# Altium project BEAGLEPLAYV020_220915.PrjPcb (part 6 of 10)

## Sheet 012_SoC DDS & HDMI.SchDoc
size 420 x 297 mm; Page Create Date: May 29, 2006; WebSite: https://www.seeedstudio.com; Variant Name: <Core Design>; Page Number: 12; Drawing: qxn; Schematic Name: BeaglePlay; Page Size: A3; Comment: Seeed Title; Page Count: 22; Page Name: 012_SoC DDS & HDMI; Company: Seeed Studio; RevCode: v0.2; DsnPath: C:\Users\a0488739\Documents\GitHub\beagleplay\allegro\DVT\BEAGLEPLAYV020_220915.DSN; SchematicName: BeaglePlay; PageName: 012_SoC DDS & HDMI; PageSize: A3; TopSchematic: True
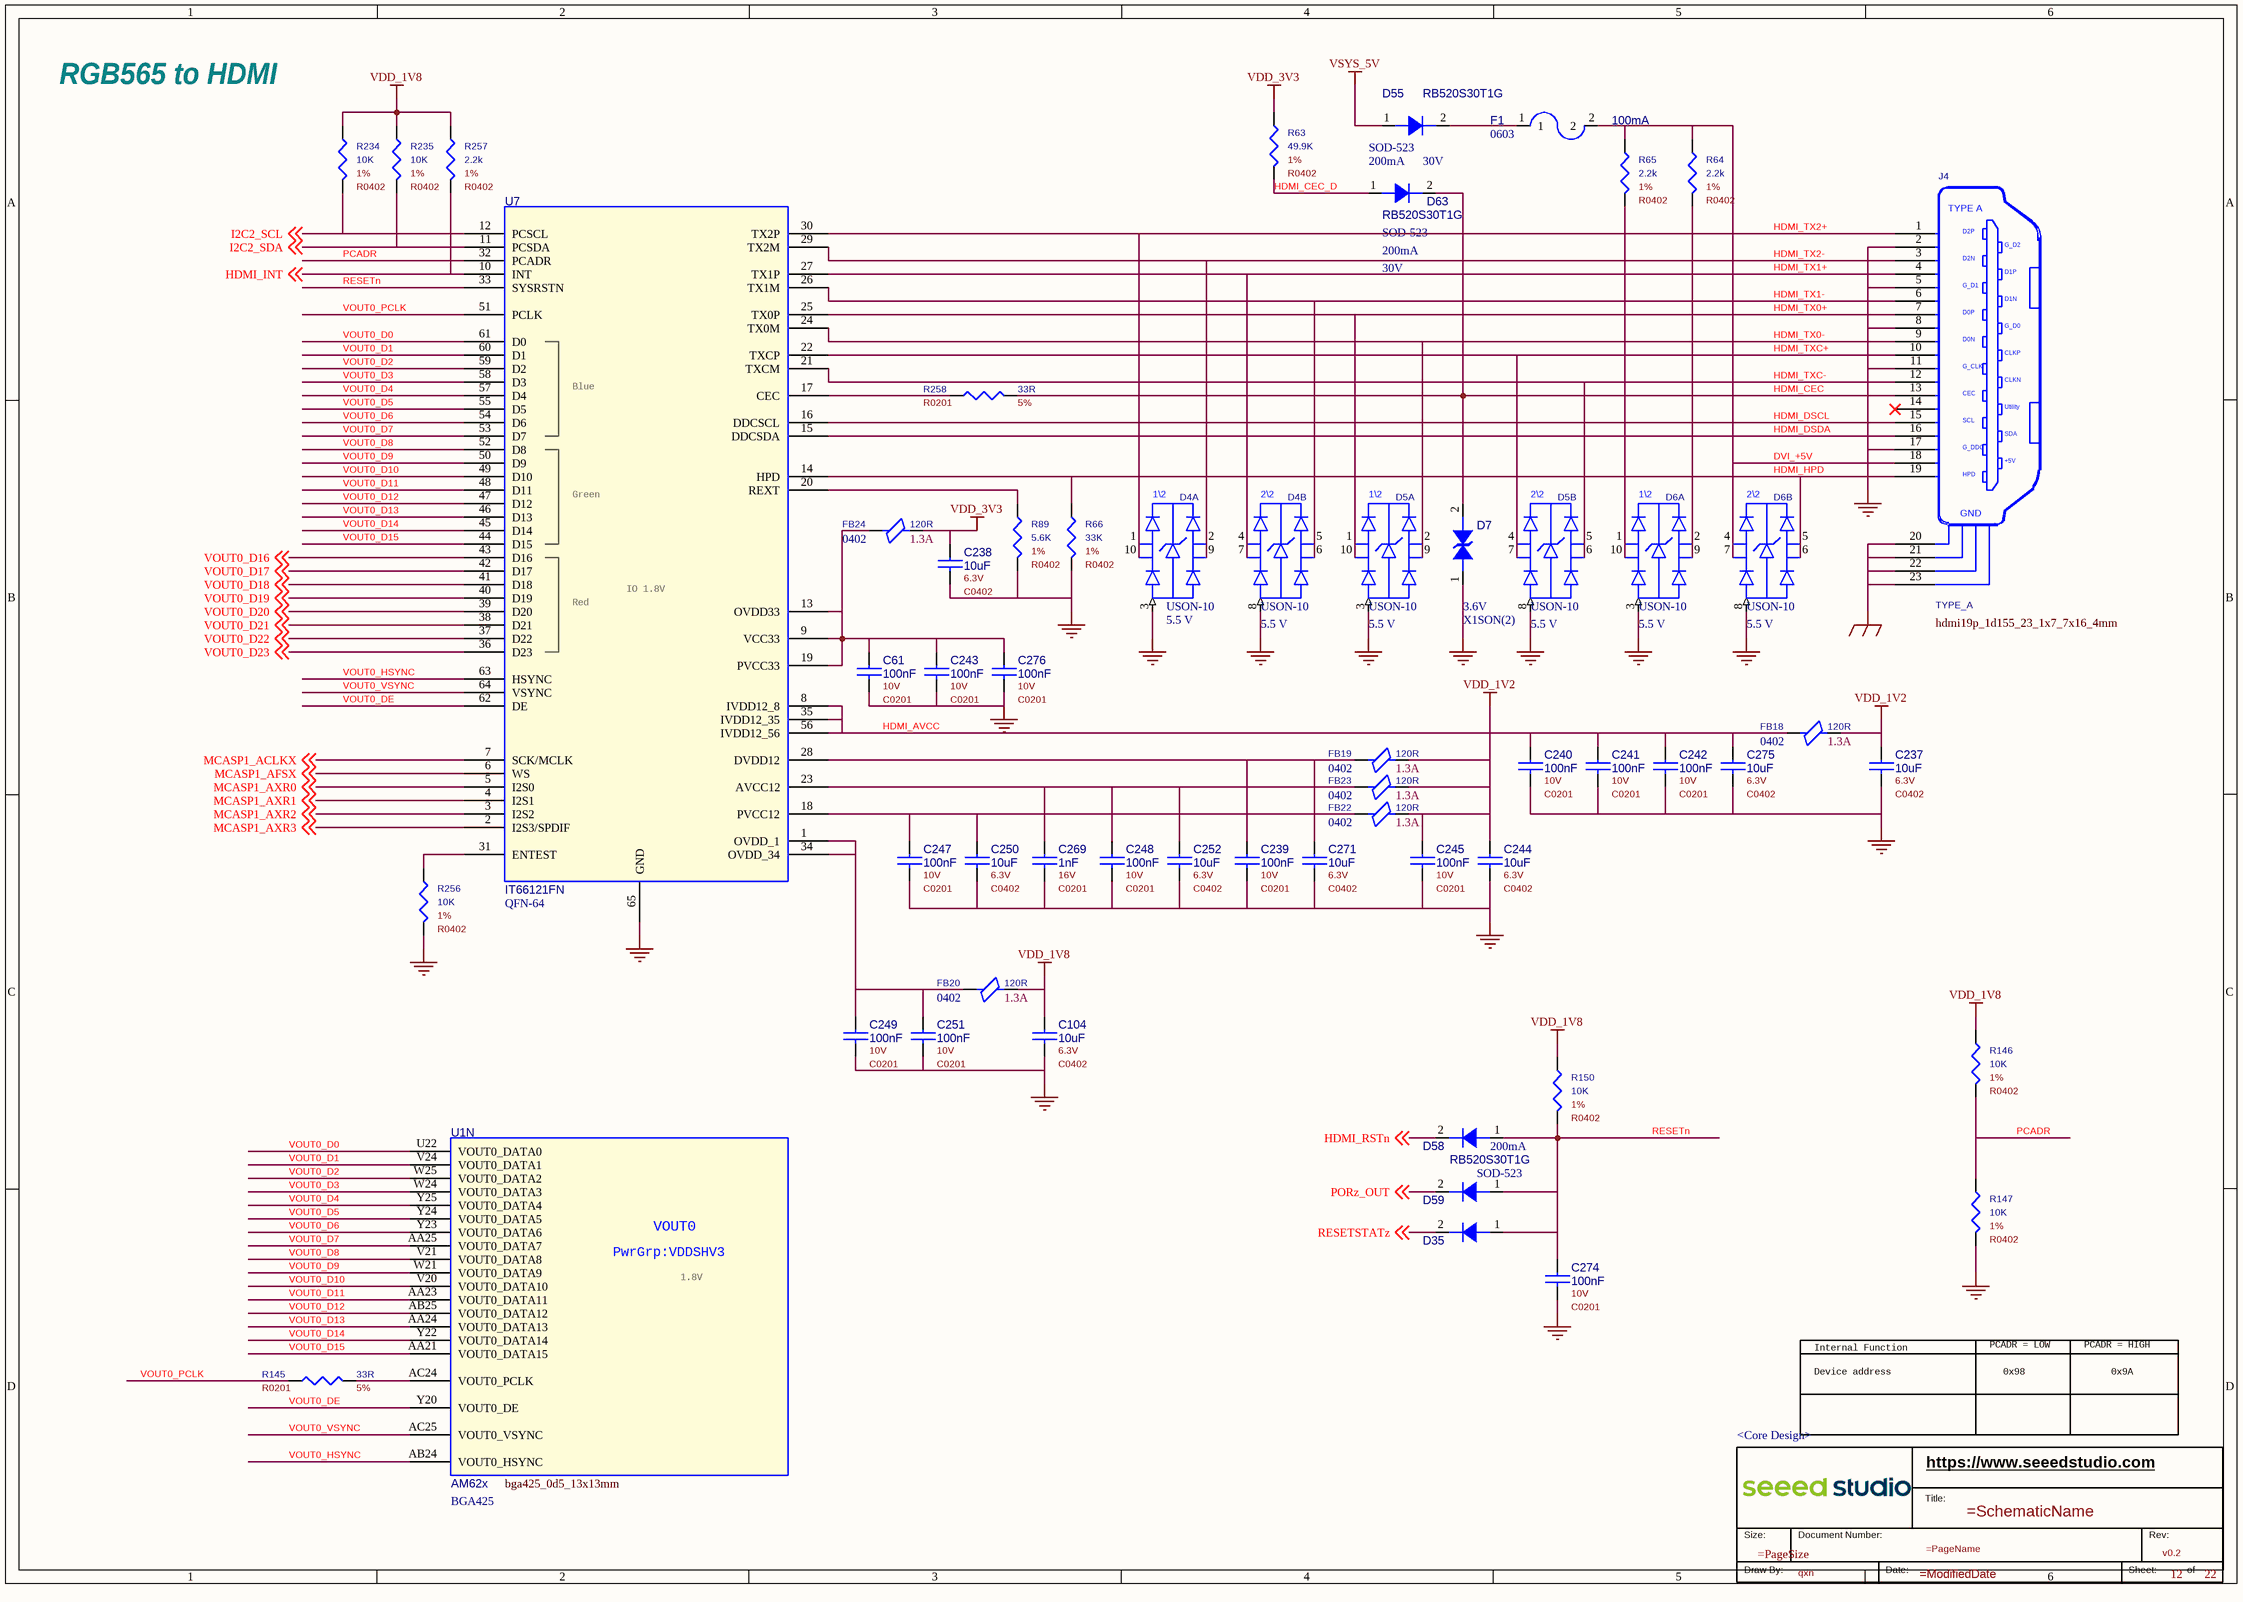
[diagram p11: 012_SoC DDS & HDMI.SchDoc]

### Parts
(Parts that share a designator on the sheet are numbered #1, #2 ... from top to bottom, then left to right.)
*#12  RevCode: v0.2  Page Number: 12  Page Count: 22  Drawing: qxn  Variant Name: <Core Design>  (hidden comment: Seeed Title)  (graphical)
C61  value 100nF  Rating: 10V  [C0201]  (hidden comment: CC)
C104  value 10uF  Rating: 6.3V  [C0402]  (hidden comment: CC)
C237  value 10uF  Rating: 6.3V  [C0402]  (hidden comment: CC)
C238  value 10uF  Rating: 6.3V  [C0402]  (hidden comment: CC)
C239  value 100nF  Rating: 10V  [C0201]  (hidden comment: CC)
C240  value 100nF  Rating: 10V  [C0201]  (hidden comment: CC)
C241  value 100nF  Rating: 10V  [C0201]  (hidden comment: CC)
C242  value 100nF  Rating: 10V  [C0201]  (hidden comment: CC)
C243  value 100nF  Rating: 10V  [C0201]  (hidden comment: CC)
C244  value 10uF  Rating: 6.3V  [C0402]  (hidden comment: CC)
C245  value 100nF  Rating: 10V  [C0201]  (hidden comment: CC)
C247  value 100nF  Rating: 10V  [C0201]  (hidden comment: CC)
C248  value 100nF  Rating: 10V  [C0201]  (hidden comment: CC)
C249  value 100nF  Rating: 10V  [C0201]  (hidden comment: CC)
C250  value 10uF  Rating: 6.3V  [C0402]  (hidden comment: CC)
C251  value 100nF  Rating: 10V  [C0201]  (hidden comment: CC)
C252  value 10uF  Rating: 6.3V  [C0402]  (hidden comment: CC)
C269  value 1nF  Rating: 16V  [C0201]  (hidden comment: CC)
C271  value 10uF  Rating: 6.3V  [C0402]  (hidden comment: CC)
C274  value 100nF  Rating: 10V  [C0201]  (hidden comment: CC)
C275  value 10uF  Rating: 6.3V  [C0402]  (hidden comment: CC)
C276  value 100nF  Rating: 10V  [C0201]  (hidden comment: CC)
D4  Rated Voltage: 5.5 V  Package Size: USON-10  [uson10_0d5_2d5x1x0d5mm]  (hidden comment: D_ESD_DIFFPAIR)  (parts A,B of 2)
D5  Rated Voltage: 5.5 V  Package Size: USON-10  [uson10_0d5_2d5x1x0d5mm]  (hidden comment: D_ESD_DIFFPAIR)  (parts A,B of 2)
D6  Package Size: USON-10  Rated Voltage: 5.5 V  [uson10_0d5_2d5x1x0d5mm]  (hidden comment: D_ESD_DIFFPAIR)  (parts A,B of 2)
D7  Package Size: X1SON(2)  Rated Voltage: 3.6V  [D0402]  (hidden comment: DIODE TVS BI-DIR)
D35  D  [sod_523]  (value not drawn)
D55  value RB520S30T1G  Repetitive Reverse Voltage Maximum: 30V  Peak Forward Current: 200mA  Package Size: SOD-523  [sod_523]  (hidden comment: D)
D58  value RB520S30T1G  Peak Forward Current: 200mA  Package Size: SOD-523  [sod_523]  (hidden comment: D)
D59  D  [sod_523]  (value not drawn)
D63  value RB520S30T1G  Package Size: SOD-523  Peak Forward Current: 200mA  Repetitive Reverse Voltage Maximum: 30V  [sod_523]  (hidden comment: D)
F1  value 100mA  Package Size: 0603  [F0603]  (hidden comment: Fuse)
FB18  value 120R  Rating: 1.3A  Package Size: 0402  [L0402]  (hidden comment: FB)
FB19  value 120R  Rating: 1.3A  Package Size: 0402  [L0402]  (hidden comment: FB)
FB20  value 120R  Rating: 1.3A  Package Size: 0402  [L0402]  (hidden comment: FB)
FB22  value 120R  Rating: 1.3A  Package Size: 0402  [L0402]  (hidden comment: FB)
FB23  value 120R  Rating: 1.3A  Package Size: 0402  [L0402]  (hidden comment: FB)
FB24  value 120R  Rating: 1.3A  Package Size: 0402  [L0402]  (hidden comment: FB)
J4  value TYPE_A  [hdmi19p_1d155_23_1x7_7x16_4mm]  (hidden comment: HDMI_Type A_19P)
R63  value 49.9K  Rating: 1%  [R0402]  (hidden comment: R)
R64  value 2.2k  Rating: 1%  [R0402]  (hidden comment: R)
R65  value 2.2k  Rating: 1%  [R0402]  (hidden comment: R)
R66  value 33K  Rating: 1%  [R0402]  (hidden comment: R)
R89  value 5.6K  Rating: 1%  [R0402]  (hidden comment: R)
R145  value 33R  Rating: 5%  [R0201]  (hidden comment: R)
R146  value 10K  Rating: 1%  [R0402]  (hidden comment: R)
R147  value 10K  Rating: 1%  [R0402]  (hidden comment: R)
R150  value 10K  Rating: 1%  [R0402]  (hidden comment: R)
R234  value 10K  Rating: 1%  [R0402]  (hidden comment: R)
R235  value 10K  Rating: 1%  [R0402]  (hidden comment: R)
R256  value 10K  Rating: 1%  [R0402]  (hidden comment: R)
R257  value 2.2k  Rating: 1%  [R0402]  (hidden comment: R)
R258  value 33R  Rating: 5%  [R0201]  (hidden comment: R)
U1  value AM62x  Package Size: BGA425  [bga425_0d5_13x13mm]  (hidden comment: AM62x_BGA425)  (part N of 19)
U7  value IT66121FN  Package Size: QFN-64  [qfn64_0d5_9x9mm]  (hidden comment: IT66121_QFN64)

### Nets
GND: C61.2 C104.2 C237.2 C238.2 C239.2 C240.2 C241.2 C242.2 C243.2 C244.2 C245.2 C247.2 C248.2 C249.2 C250.2 C251.2 C252.2 C269.2 C271.2 C274.2 C275.2 C276.2 D4.3(GND1) D4.8(GND1) D5.3(GND1) D5.8(GND1) D6.3(GND1) D6.8(GND1) D7.1 J4.2(D2GND) J4.5(D1GND) J4.8(D0GND) J4.11(CKGND) J4.17(DDCGND) R66.2 R89.2 R147.2 R256.2 U7.65(GND)
GND_EARTH: J4.20(GND1) J4.21(GND2) J4.22(GND3) J4.23(GND4)
VDD_1V2: C237.1 C244.1 C245.1 FB18.2 FB19.2 FB22.2 FB23.2
VDD_1V8: C104.1 FB20.2 R146.1 R150.1 R234.1 R235.1 R257.1
VDD_3V3: C238.1 FB24.2 R63.1
VSYS_5V: D55.1(A)
DVI_+5V: D6.4(3A) D6.7(3B) F1.2 J4.18(+5V) R64.1 R65.1
HDMI_AVCC: C240.1 C241.1 C242.1 C275.1 FB18.1 U7.8(IVDD12_8) U7.35(IVDD12_35) U7.56(IVDD12_56)
HDMI_CEC: D7.2 D63.2(C) J4.13(CEC) R258.2
HDMI_CEC_D: D63.1(A) R63.2
HDMI_DSCL: D6.1(1A) D6.10(1B) J4.15(SCL) R65.2 U7.16(DDCSCL)
HDMI_DSDA: D6.2(2A) D6.9(2B) J4.16(SDA) R64.2 U7.15(DDCSDA)
HDMI_HPD: D6.5(4A) D6.6(4B) J4.19(HPD) R66.1 U7.14(HPD)
HDMI_INT: R257.2 U7.10(INT) ; off-sheet HDMI_INT
HDMI_RSTn: D58.2(C) ; off-sheet HDMI_RSTn  [project net BOOTMODE6]
HDMI_TX0+: D5.1(1A) D5.10(1B) J4.7(D0+) U7.25(TX0P)
HDMI_TX0-: D5.2(2A) D5.9(2B) J4.9(D0-) U7.24(TX0M)
HDMI_TX1+: D4.4(3A) D4.7(3B) J4.4(D1+) U7.27(TX1P)
HDMI_TX1-: D4.5(4A) D4.6(4B) J4.6(D1-) U7.26(TX1M)
HDMI_TX2+: D4.1(1A) D4.10(1B) J4.1(D2+) U7.30(TX2P)
HDMI_TX2-: D4.2(2A) D4.9(2B) J4.3(D2-) U7.29(TX2M)
HDMI_TXC+: D5.4(3A) D5.7(3B) J4.10(CK+) U7.22(TXCP)
HDMI_TXC-: D5.5(4A) D5.6(4B) J4.12(CK-) U7.21(TXCM)
I2C2_SCL: R234.2 U7.12(PCSCL) ; off-sheet I2C2_SCL
I2C2_SDA: R235.2 U7.11(PCSDA) ; off-sheet I2C2_SDA
MCASP1_ACLKX: U7.7(SCK/MCLK) ; off-sheet MCASP1_ACLKX
MCASP1_AFSX: U7.6(WS) ; off-sheet MCASP1_AFSX
MCASP1_AXR0: U7.5(I2S0) ; off-sheet MCASP1_AXR0
MCASP1_AXR1: U7.4(I2S1) ; off-sheet MCASP1_AXR1
MCASP1_AXR2: U7.3(I2S2) ; off-sheet MCASP1_AXR2
MCASP1_AXR3: U7.2(I2S3/SPDIF) ; off-sheet MCASP1_AXR3
PCADR: R146.2 R147.1 U7.32(PCADR)
PORz_OUT: D59.2(C) ; off-sheet PORz_OUT
RESETn: C274.1 D35.1(A) D58.1(A) D59.1(A) R150.2 U7.33(SYSRSTN)
RESETSTATz: D35.2(C) ; off-sheet RESETSTATz
VOUT0_D0: U1.U22(VOUT0_DATA0) U7.61(D0)
VOUT0_D1: U1.V24(VOUT0_DATA1) U7.60(D1)
VOUT0_D2: U1.W25(VOUT0_DATA2) U7.59(D2)
VOUT0_D3: U1.W24(VOUT0_DATA3) U7.58(D3)
VOUT0_D4: U1.Y25(VOUT0_DATA4) U7.57(D4)
VOUT0_D5: U1.Y24(VOUT0_DATA5) U7.55(D5)
VOUT0_D6: U1.Y23(VOUT0_DATA6) U7.54(D6)
VOUT0_D7: U1.AA25(VOUT0_DATA7) U7.53(D7)
VOUT0_D8: U1.V21(VOUT0_DATA8) U7.52(D8)
VOUT0_D9: U1.W21(VOUT0_DATA9) U7.50(D9)
VOUT0_D10: U1.V20(VOUT0_DATA10) U7.49(D10)
VOUT0_D11: U1.AA23(VOUT0_DATA11) U7.48(D11)
VOUT0_D12: U1.AB25(VOUT0_DATA12) U7.47(D12)
VOUT0_D13: U1.AA24(VOUT0_DATA13) U7.46(D13)
VOUT0_D14: U1.Y22(VOUT0_DATA14) U7.45(D14)
VOUT0_D15: U1.AA21(VOUT0_DATA15) U7.44(D15)
VOUT0_D16: U7.43(D16) ; off-sheet VOUT0_D16
VOUT0_D17: U7.42(D17) ; off-sheet VOUT0_D17
VOUT0_D18: U7.41(D18) ; off-sheet VOUT0_D18
VOUT0_D19: U7.40(D19) ; off-sheet VOUT0_D19
VOUT0_D20: U7.39(D20) ; off-sheet VOUT0_D20
VOUT0_D21: U7.38(D21) ; off-sheet VOUT0_D21
VOUT0_D22: U7.37(D22) ; off-sheet VOUT0_D22
VOUT0_D23: U7.36(D23) ; off-sheet VOUT0_D23
VOUT0_DE: U1.Y20(VOUT0_DE) U7.62(DE)
VOUT0_HSYNC: U1.AB24(VOUT0_HSYNC) U7.63(HSYNC)
VOUT0_PCLK: R145.1 U7.51(PCLK)
VOUT0_VSYNC: U1.AC25(VOUT0_VSYNC) U7.64(VSYNC)
NetC61_1: C61.1 C243.1 C276.1 FB24.1 U7.9(VCC33) U7.13(OVDD33) U7.19(PVCC33)
NetC239_1: C239.1 C271.1 FB19.1 U7.28(DVDD12)
NetC247_1: C247.1 C250.1 FB22.1 U7.18(PVCC12)
NetC248_1: C248.1 C252.1 C269.1 FB23.1 U7.23(AVCC12)
NetC249_1: C249.1 C251.1 FB20.1 U7.1(OVDD_1) U7.34(OVDD_34)
NetD55_2: D55.2(C) F1.1
NetR89_1: R89.1 U7.20(REXT)
NetR145_2: R145.2 U1.AC24(VOUT0_PCLK)
NetR256_1: R256.1 U7.31(ENTEST)
NetR258_1: R258.1 U7.17(CEC)

Not connected (* = marked no-connect by the designer): J4 14(Utility)*

### Notes on the sheet
- RGB565 to HDMI
- (near U7) Blue
- (near U7) Green
- (near U7) IO 1.8V
- (near U7) Red
- 1.8V
- Internal Function
- Device address
- PCADR = LOW
- 0x98
- PCADR = HIGH
- 0x9A
- (in symbol AM62x_BGA425, part N) VOUT0; PwrGrp:VDDSHV3
- (in symbol D_ESD_DIFFPAIR, part A) 1\2
- (in symbol D_ESD_DIFFPAIR, part B) 2\2
- (in symbol HDMI_Type A_19P) TYPE A; D2P; G_D2; D2N; D1P; G_D1; D1N; D0P; G_D0; D0N; CLKP; G_CLK; CLKN; G_DDC; GND
- (in symbol Seeed Title) https://www.seeedstudio.com; Title:; Size:; Document Number:; Rev:; Draw By:; Date:; Sheet:; of

### Library data of the parts
*#12 = Seeed Title: Company: Seeed Studio; WebSite: https://www.seeedstudio.com; Schematic Name: =SchematicName; Page Size: =PageSize; Page Name: =PageName; Page Create Date: May 29, 2006; Page Modify Date: =ModifiedDate
C61 = CC: CAP, Ceramic, SMD, 100nF, 10%, 10V, 0201; Part Reference: C61; Manufacturer PN: CC0201KRX5R6BB104; Manufacturer: YAGEO; Company Part Status: ODYSSEY-i.MX8M; CLASS: DISCRETE; Temperature Coefficient: X5R; PN: 302010271; PCB Footprint: C0201; Tolerance: 10%; Dielectric Type: Ceramic; Package Size: 0201
C104 = CC: CAP, Ceramic, SMD, 10uF, 20%, 6.3V, 0402; Part Reference: C104; Manufacturer PN: CC0402MRX5R5BB106; Manufacturer: YAGEO; Company Part Status: ST; CLASS: DISCRETE; PN: 302010053; PCB Footprint: C0402; Tolerance: 20%; Dielectric Type: Ceramic; Package Size: 0402
C237 = CC: CAP, Ceramic, SMD, 10uF, 20%, 6.3V, 0402; Part Reference: C237; Company Part Status: ST; Manufacturer: YAGEO; Manufacturer PN: CC0402MRX5R5BB106; PN: 302010053; CLASS: DISCRETE; PCB Footprint: C0402; Package Size: 0402; Dielectric Type: Ceramic; Tolerance: 20%
C238 = CC: CAP, Ceramic, SMD, 10uF, 20%, 6.3V, 0402; Part Reference: C238; Company Part Status: ST; Manufacturer: YAGEO; Manufacturer PN: CC0402MRX5R5BB106; PN: 302010053; CLASS: DISCRETE; PCB Footprint: C0402; Package Size: 0402; Dielectric Type: Ceramic; Tolerance: 20%
C239 = CC: CAP, Ceramic, SMD, 100nF, 10%, 10V, 0201; Part Reference: C239; Manufacturer PN: CC0201KRX5R6BB104; Manufacturer: YAGEO; Company Part Status: ODYSSEY-i.MX8M; CLASS: DISCRETE; Temperature Coefficient: X5R; PN: 302010271; PCB Footprint: C0201; Tolerance: 10%; Dielectric Type: Ceramic; Package Size: 0201
C240 = CC: CAP, Ceramic, SMD, 100nF, 10%, 10V, 0201; Part Reference: C240; Company Part Status: ODYSSEY-i.MX8M; Manufacturer: YAGEO; Manufacturer PN: CC0201KRX5R6BB104; PN: 302010271; Temperature Coefficient: X5R; CLASS: DISCRETE; PCB Footprint: C0201; Package Size: 0201; Dielectric Type: Ceramic; Tolerance: 10%
C241 = CC: CAP, Ceramic, SMD, 100nF, 10%, 10V, 0201; Part Reference: C241; Company Part Status: ODYSSEY-i.MX8M; Manufacturer: YAGEO; Manufacturer PN: CC0201KRX5R6BB104; PN: 302010271; Temperature Coefficient: X5R; CLASS: DISCRETE; PCB Footprint: C0201; Package Size: 0201; Dielectric Type: Ceramic; Tolerance: 10%
C242 = CC: CAP, Ceramic, SMD, 100nF, 10%, 10V, 0201; Part Reference: C242; Company Part Status: ODYSSEY-i.MX8M; Manufacturer: YAGEO; Manufacturer PN: CC0201KRX5R6BB104; PN: 302010271; Temperature Coefficient: X5R; CLASS: DISCRETE; PCB Footprint: C0201; Package Size: 0201; Dielectric Type: Ceramic; Tolerance: 10%
C243 = CC: CAP, Ceramic, SMD, 100nF, 10%, 10V, 0201; Part Reference: C243; Manufacturer PN: CC0201KRX5R6BB104; Manufacturer: YAGEO; Company Part Status: ODYSSEY-i.MX8M; CLASS: DISCRETE; Temperature Coefficient: X5R; PN: 302010271; PCB Footprint: C0201; Tolerance: 10%; Dielectric Type: Ceramic; Package Size: 0201
C244 = CC: CAP, Ceramic, SMD, 10uF, 20%, 6.3V, 0402; Part Reference: C244; Manufacturer PN: CC0402MRX5R5BB106; Manufacturer: YAGEO; Company Part Status: ST; CLASS: DISCRETE; PN: 302010053; PCB Footprint: C0402; Tolerance: 20%; Dielectric Type: Ceramic; Package Size: 0402
C245 = CC: CAP, Ceramic, SMD, 100nF, 10%, 10V, 0201; Part Reference: C245; Company Part Status: ODYSSEY-i.MX8M; Manufacturer: YAGEO; Manufacturer PN: CC0201KRX5R6BB104; PN: 302010271; Temperature Coefficient: X5R; CLASS: DISCRETE; PCB Footprint: C0201; Package Size: 0201; Dielectric Type: Ceramic; Tolerance: 10%
C247 = CC: CAP, Ceramic, SMD, 100nF, 10%, 10V, 0201; Part Reference: C247; Manufacturer PN: CC0201KRX5R6BB104; Manufacturer: YAGEO; Company Part Status: ODYSSEY-i.MX8M; CLASS: DISCRETE; Temperature Coefficient: X5R; PN: 302010271; PCB Footprint: C0201; Tolerance: 10%; Dielectric Type: Ceramic; Package Size: 0201
C248 = CC: CAP, Ceramic, SMD, 100nF, 10%, 10V, 0201; Part Reference: C248; Company Part Status: ODYSSEY-i.MX8M; Manufacturer: YAGEO; Manufacturer PN: CC0201KRX5R6BB104; PN: 302010271; Temperature Coefficient: X5R; CLASS: DISCRETE; PCB Footprint: C0201; Package Size: 0201; Dielectric Type: Ceramic; Tolerance: 10%
C249 = CC: CAP, Ceramic, SMD, 100nF, 10%, 10V, 0201; Part Reference: C249; Company Part Status: ODYSSEY-i.MX8M; Manufacturer: YAGEO; Manufacturer PN: CC0201KRX5R6BB104; PN: 302010271; Temperature Coefficient: X5R; CLASS: DISCRETE; PCB Footprint: C0201; Package Size: 0201; Dielectric Type: Ceramic; Tolerance: 10%
C250 = CC: CAP, Ceramic, SMD, 10uF, 20%, 6.3V, 0402; Part Reference: C250; Manufacturer PN: CC0402MRX5R5BB106; Manufacturer: YAGEO; Company Part Status: ST; CLASS: DISCRETE; PN: 302010053; PCB Footprint: C0402; Tolerance: 20%; Dielectric Type: Ceramic; Package Size: 0402
C251 = CC: CAP, Ceramic, SMD, 100nF, 10%, 10V, 0201; Part Reference: C251; Company Part Status: ODYSSEY-i.MX8M; Manufacturer: YAGEO; Manufacturer PN: CC0201KRX5R6BB104; PN: 302010271; Temperature Coefficient: X5R; CLASS: DISCRETE; PCB Footprint: C0201; Package Size: 0201; Dielectric Type: Ceramic; Tolerance: 10%
C252 = CC: CAP, Ceramic, SMD, 10uF, 20%, 6.3V, 0402; Part Reference: C252; Manufacturer PN: CC0402MRX5R5BB106; Manufacturer: YAGEO; Company Part Status: ST; CLASS: DISCRETE; PN: 302010053; PCB Footprint: C0402; Tolerance: 20%; Dielectric Type: Ceramic; Package Size: 0402
C269 = CC: CAP, Ceramic, SMD, 1nF, 10%, 16V, 0201; Part Reference: C269; Manufacturer PN: CC0201KRX7R7BB102; Manufacturer: YAGEO; Company Part Status: BeagleX; CLASS: DISCRETE; Temperature Coefficient: X7R; PN: 302010389; PCB Footprint: C0201; Tolerance: 10%; Dielectric Type: Ceramic; Package Size: 0201
C271 = CC: CAP, Ceramic, SMD, 10uF, 20%, 6.3V, 0402; Part Reference: C271; Manufacturer PN: CC0402MRX5R5BB106; Manufacturer: YAGEO; Company Part Status: ST; CLASS: DISCRETE; PN: 302010053; PCB Footprint: C0402; Tolerance: 20%; Dielectric Type: Ceramic; Package Size: 0402
C274 = CC: CAP, Ceramic, SMD, 100nF, 10%, 10V, 0201; Part Reference: C274; Company Part Status: ODYSSEY-i.MX8M; Manufacturer: YAGEO; Manufacturer PN: CC0201KRX5R6BB104; PN: 302010271; Temperature Coefficient: X5R; CLASS: DISCRETE; PCB Footprint: C0201; Package Size: 0201; Dielectric Type: Ceramic; Tolerance: 10%
C275 = CC: CAP, Ceramic, SMD, 10uF, 20%, 6.3V, 0402; Part Reference: C275; Company Part Status: ST; Manufacturer: YAGEO; Manufacturer PN: CC0402MRX5R5BB106; PN: 302010053; CLASS: DISCRETE; PCB Footprint: C0402; Package Size: 0402; Dielectric Type: Ceramic; Tolerance: 20%
C276 = CC: CAP, Ceramic, SMD, 100nF, 10%, 10V, 0201; Part Reference: C276; Manufacturer PN: CC0201KRX5R6BB104; Manufacturer: YAGEO; Company Part Status: ODYSSEY-i.MX8M; CLASS: DISCRETE; Temperature Coefficient: X5R; PN: 302010271; PCB Footprint: C0201; Tolerance: 10%; Dielectric Type: Ceramic; Package Size: 0201
D4 = D_ESD_DIFFPAIR: DIO, ESD, TPD4E05U06DQAR, --, 5.5 V, --, USON-10; Part Reference: D4; Company Part Status: JetsonMate; Manufacturer: TI; CLASS: DISCRETE; Repetitive Reverse Voltage Maximum: 6.5 V; PN: 304060294; Value: TPD4E05U06DQAR; PCB Footprint: uson10_0d5_2d5x1x0d5mm; Manufacturer PN: TPD4E05U06DQAR
D5 = D_ESD_DIFFPAIR: DIO, ESD, TPD4E05U06DQAR, --, 5.5 V, --, USON-10; Part Reference: D5; Company Part Status: JetsonMate; Manufacturer: TI; CLASS: DISCRETE; Repetitive Reverse Voltage Maximum: 6.5 V; PN: 304060294; Value: TPD4E05U06DQAR; PCB Footprint: uson10_0d5_2d5x1x0d5mm; Manufacturer PN: TPD4E05U06DQAR
D6 = D_ESD_DIFFPAIR: DIO, ESD, TPD4E05U06DQAR, --, 5.5 V, --, USON-10; Part Reference: D6; Manufacturer: TI; Company Part Status: JetsonMate; PN: 304060294; Repetitive Reverse Voltage Maximum: 6.5 V; CLASS: DISCRETE; Value: TPD4E05U06DQAR; PCB Footprint: uson10_0d5_2d5x1x0d5mm; Manufacturer PN: TPD4E05U06DQAR
D7 = DIODE TVS BI-DIR: DIO, ESD, TPD1E1B04DPY, --, 3.6V, --, X1SON(2); Part Reference: D7; Company Part Status: Grove Base Cape for PocketBeagle; Manufacturer: TI; Manufacturer PN: TPD1E1B04DPYR; PN: 304050798; CLASS: DISCRETE; PCB Footprint: D0402; Value: TPD1E1B04DPY
D35 = D: DIO, Schottky, RB520S30T1G, , , , SOD-523; Part Reference: D35; Manufacturer: ON; Company Part Status: SCG Vehicle Device; CLASS: DISCRETE; Repetitive Reverse Voltage Maximum: 30V; Peak Forward Current: 200mA; PN: 304020782; PCB Footprint: sod_523; Value: RB520S30T1G; Manufacturer PN: RB520S30T1G; Package Size: SOD-523
D55 = D: DIO, Schottky, RB520S30T1G, , , , SOD-523; Part Reference: D55; Manufacturer: ON; Company Part Status: SCG Vehicle Device; CLASS: DISCRETE; PN: 304020782; PCB Footprint: sod_523; Manufacturer PN: RB520S30T1G
D58 = D: DIO, Schottky, RB520S30T1G, , , , SOD-523; Part Reference: D58; Manufacturer: ON; Company Part Status: SCG Vehicle Device; CLASS: DISCRETE; Repetitive Reverse Voltage Maximum: 30V; PN: 304020782; PCB Footprint: sod_523; Manufacturer PN: RB520S30T1G
D59 = D: DIO, Schottky, RB520S30T1G, , , , SOD-523; Part Reference: D59; Manufacturer: ON; Company Part Status: SCG Vehicle Device; CLASS: DISCRETE; Repetitive Reverse Voltage Maximum: 30V; Peak Forward Current: 200mA; PN: 304020782; PCB Footprint: sod_523; Value: RB520S30T1G; Manufacturer PN: RB520S30T1G; Package Size: SOD-523
D63 = D: DIO, Schottky, RB520S30T1G, , , , SOD-523; Part Reference: D63; Company Part Status: SCG Vehicle Device; Manufacturer: ON; PN: 304020782; CLASS: DISCRETE; PCB Footprint: sod_523; Manufacturer PN: RB520S30T1G
F1 = Fuse: MISC, Fuse, 100mA, SMD, 0603; Part Reference: F1; Manufacturer PN: MF-FSMF010X; Manufacturer: Bourns; Company Part Status: Jetson Nano Cluster; CLASS: DISCRETE; PN: 307010054; PCB Footprint: F0603
FB18 = FB: Ferrite Bead, 120R, , 1.3A, 0402; Part Reference: FB18; Company Part Status: BeagleBone Carrier Board; Manufacturer: Murata; Manufacturer PN: BLM15PD121SN1D; PN: 303030040; CLASS: DISCRETE; PCB Footprint: L0402
FB19 = FB: Ferrite Bead, 120R, , 1.3A, 0402; Part Reference: FB19; Company Part Status: BeagleBone Carrier Board; Manufacturer: Murata; Manufacturer PN: BLM15PD121SN1D; PN: 303030040; CLASS: DISCRETE; PCB Footprint: L0402
FB20 = FB: Ferrite Bead, 120R, , 1.3A, 0402; Part Reference: FB20; Manufacturer PN: BLM15PD121SN1D; Manufacturer: Murata; Company Part Status: BeagleBone Carrier Board; CLASS: DISCRETE; PN: 303030040; PCB Footprint: L0402
FB22 = FB: Ferrite Bead, 120R, , 1.3A, 0402; Part Reference: FB22; Company Part Status: BeagleBone Carrier Board; Manufacturer: Murata; Manufacturer PN: BLM15PD121SN1D; PN: 303030040; CLASS: DISCRETE; PCB Footprint: L0402
FB23 = FB: Ferrite Bead, 120R, , 1.3A, 0402; Part Reference: FB23; Manufacturer PN: BLM15PD121SN1D; Manufacturer: Murata; Company Part Status: BeagleBone Carrier Board; CLASS: DISCRETE; PN: 303030040; PCB Footprint: L0402
FB24 = FB: Ferrite Bead, 120R, , 1.3A, 0402; Part Reference: FB24; Company Part Status: BeagleBone Carrier Board; Manufacturer: Murata; Manufacturer PN: BLM15PD121SN1D; PN: 303030040; CLASS: DISCRETE; PCB Footprint: L0402
J4 = HDMI_Type A_19P: CONN, HDMI, TYPE_A, 19+4P, DIP; Part Reference: J4; Manufacturer: SUNGTECH; Manufacturer PN: ST-HD-001C; PN: 320010999; Contact Voltage: 500 V; CLASS: IO; PCB Footprint: hdmi19p_1d155_23_1x7_7x16_4mm; Package Size: 23.1 x 7.7mm
R63 = R: RES, Thick Film, 49.9K, 1%, 1/16W, SMD, 0402; Part Reference: R63; Manufacturer PN: RC0402FR-0749K9L; Manufacturer: YAGEO; CLASS: DISCRETE; PN: 301010457; PCB Footprint: R0402; Rated Power: 1/16W; Package Size: 0402
R64 = R: RES, Thick Film, 2.2k, 1%, 1/16W, SMD, 0402; Part Reference: R64; Manufacturer PN: RC0402FR-072K2L; Manufacturer: YAGEO; Company Part Status: ST; CLASS: DISCRETE; PN: 301010746; PCB Footprint: R0402; Rated Power: 1/16W; Package Size: 0402
R65 = R: RES, Thick Film, 2.2k, 1%, 1/16W, SMD, 0402; Part Reference: R65; Company Part Status: ST; Manufacturer: YAGEO; Manufacturer PN: RC0402FR-072K2L; PN: 301010746; CLASS: DISCRETE; PCB Footprint: R0402; Package Size: 0402; Rated Power: 1/16W
R66 = R: RES, Thick Film, 33K, 1%, 1/16W, SMD, 0402; Part Reference: R66; Manufacturer PN: RC0402FR-0733KL; Manufacturer: YAGEO; CLASS: DISCRETE; PN: 301010441; PCB Footprint: R0402; Package Size: 0402; Rated Power: 1/16W
R89 = R: RES, Thick Film, 5.6K, 1%, 1/16W, SMD, 0402; Part Reference: R89; Manufacturer PN: CRCW04025K60FKED; Manufacturer: Vishay; Company Part Status: BeaglePlay; CLASS: DISCRETE; PN: 301010546; PCB Footprint: R0402; Rated Power: 1/16W; Package Size: 0402
R145 = R: RES, Thick Film, 33R, 5%, 1/20W, SMD, 0201; Part Reference: R145; Manufacturer PN: RC0201JR-0733RL; Manufacturer: YAGEO; Company Part Status: BeagleBone Carrier Board; CLASS: DISCRETE; PN: 301010675; PCB Footprint: R0201; Rated Power: 1/20W; Package Size: 0201
R146 = R: RES, Thick Film, 10K, 1%, 1/16W, SMD, 0402; Part Reference: R146; Company Part Status: BeagleBone Carrier Board; Manufacturer: YAGEO; Manufacturer PN: RC0402FR-0710KL; PN: 301010047; CLASS: DISCRETE; PCB Footprint: R0402; Package Size: 0402; Rated Power: 1/16W
R147 = R: RES, Thick Film, 10K, 1%, 1/16W, SMD, 0402; Part Reference: R147; Company Part Status: BeagleBone Carrier Board; Manufacturer: YAGEO; Manufacturer PN: RC0402FR-0710KL; PN: 301010047; CLASS: DISCRETE; PCB Footprint: R0402; Package Size: 0402; Rated Power: 1/16W
R150 = R: RES, Thick Film, 10K, 1%, 1/16W, SMD, 0402; Part Reference: R150; Manufacturer PN: RC0402FR-0710KL; Manufacturer: YAGEO; Company Part Status: BeagleBone Carrier Board; CLASS: DISCRETE; PN: 301010047; PCB Footprint: R0402; Rated Power: 1/16W; Package Size: 0402
R234 = R: RES, Thick Film, 10K, 1%, 1/16W, SMD, 0402; Part Reference: R234; Manufacturer PN: RC0402FR-0710KL; Manufacturer: YAGEO; Company Part Status: BeagleBone Carrier Board; CLASS: DISCRETE; PN: 301010047; PCB Footprint: R0402; Package Size: 0402; Rated Power: 1/16W
R235 = R: RES, Thick Film, 10K, 1%, 1/16W, SMD, 0402; Part Reference: R235; Manufacturer PN: RC0402FR-0710KL; Manufacturer: YAGEO; Company Part Status: BeagleBone Carrier Board; CLASS: DISCRETE; PN: 301010047; PCB Footprint: R0402; Package Size: 0402; Rated Power: 1/16W
R256 = R: RES, Thick Film, 10K, 1%, 1/16W, SMD, 0402; Part Reference: R256; Company Part Status: BeagleBone Carrier Board; Manufacturer: YAGEO; Manufacturer PN: RC0402FR-0710KL; PN: 301010047; CLASS: DISCRETE; PCB Footprint: R0402; Rated Power: 1/16W; Package Size: 0402
R257 = R: RES, Thick Film, 2.2k, 1%, 1/16W, SMD, 0402; Part Reference: R257; Manufacturer PN: RC0402FR-072K2L; Manufacturer: YAGEO; Company Part Status: ST; CLASS: DISCRETE; PN: 301010746; PCB Footprint: R0402; Rated Power: 1/16W; Package Size: 0402
R258 = R: RES, Thick Film, 33R, 5%, 1/20W, SMD, 0201; Part Reference: R258; Manufacturer PN: RC0201JR-0733RL; Manufacturer: YAGEO; Company Part Status: BeagleBone Carrier Board; CLASS: DISCRETE; PN: 301010675; PCB Footprint: R0201; Rated Power: 1/20W; Package Size: 0201
U1 = AM62x_BGA425: IC, Controller, MPU, AM62x, BGA425; Part Reference: U1; Company Part Status: BeaglePlay; Manufacturer: TI; Manufacturer PN: AM6254ATCGGHALWR; PN: 310011537; PCB Footprint: bga425_0d5_13x13mm; CLASS: IC
U7 = IT66121_QFN64: IC, Interface, HDMI Transceiver, IT66121FN, QFN-64; Part Reference: U7; Manufacturer: ITE; Company Part Status: BeaglePlay; PN: 310110021; PCB Footprint: qfn64_0d5_9x9mm; Manufacturer PN: IT66121FN; CLASS: IC

## Sheet 013_SoC GPIO 3.3V.SchDoc
size 420 x 297 mm; Page Create Date: May 29, 2006; WebSite: https://www.seeedstudio.com; Page Number: 13; Drawing: qxn; Schematic Name: BeaglePlay; Page Size: A3; Comment: Seeed Title; Page Count: 22; Page Name: 013_SoC GPIO 3.3V; Company: Seeed Studio; RevCode: v0.2; DsnPath: C:\Users\a0488739\Documents\GitHub\beagleplay\allegro\DVT\BEAGLEPLAYV020_220915.DSN; SchematicName: BeaglePlay; PageName: 013_SoC GPIO 3.3V; PageSize: A3; TopSchematic: True
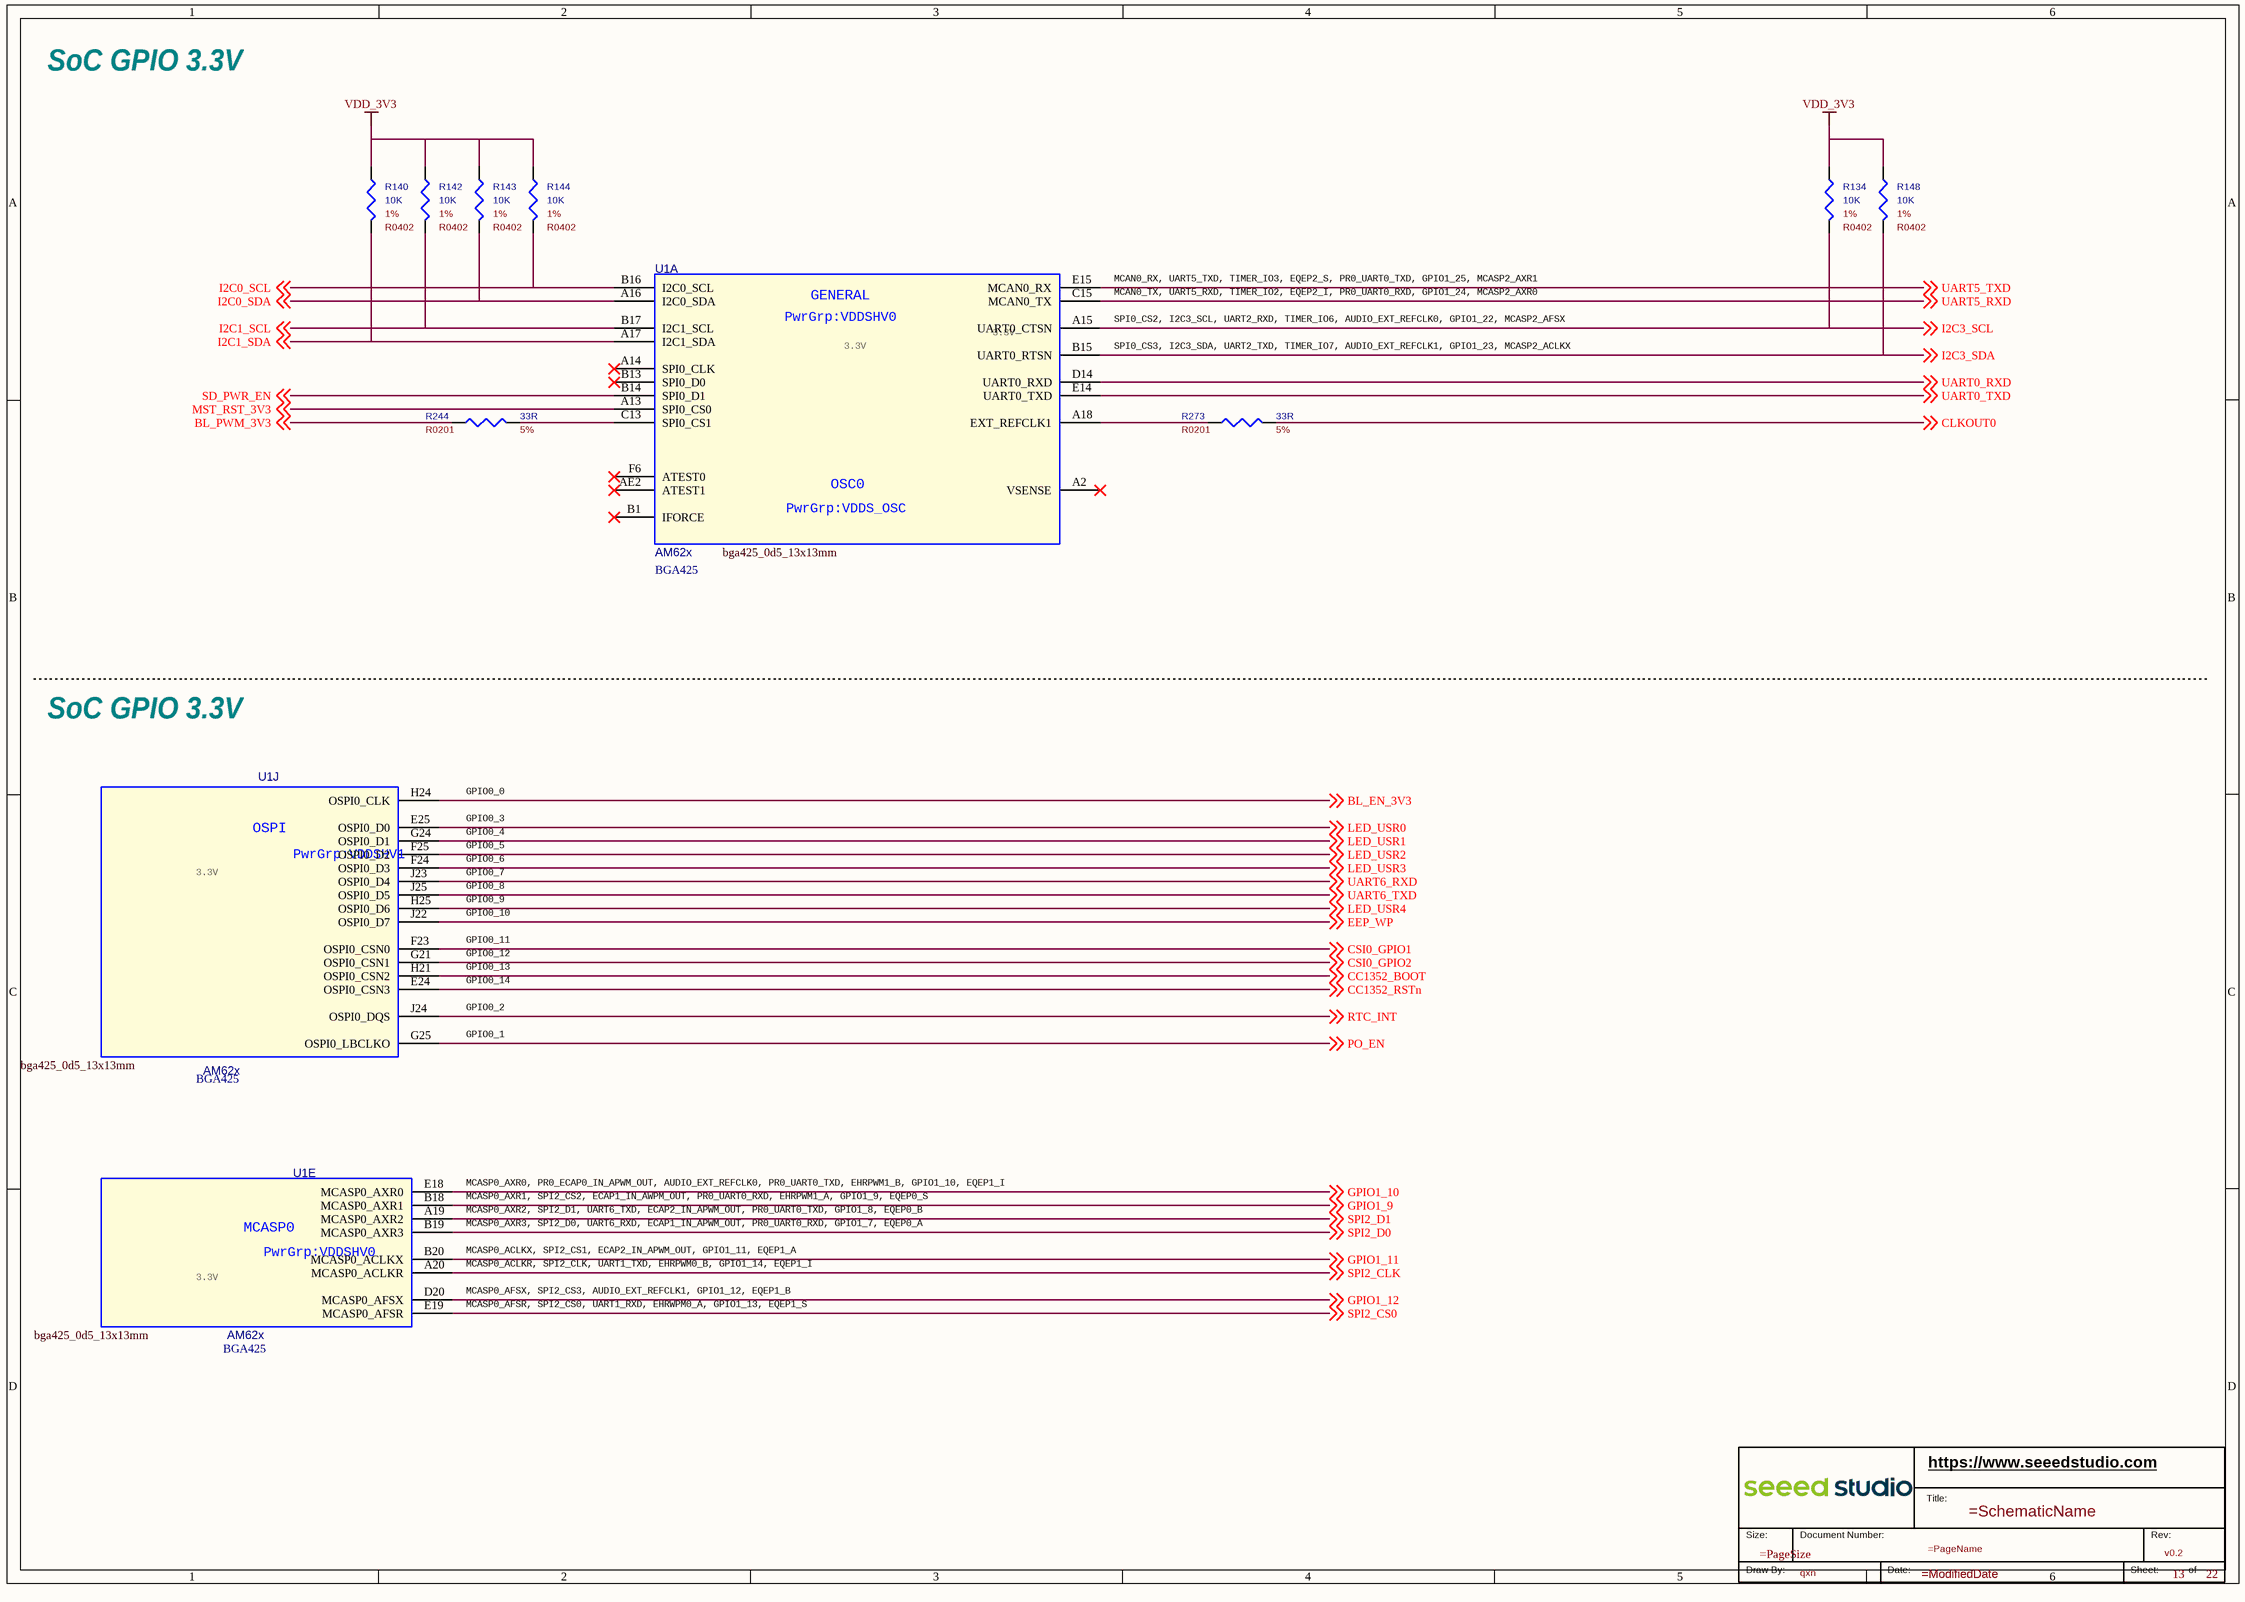
[diagram p12: 013_SoC GPIO 3.3V.SchDoc]

### Parts
(Parts that share a designator on the sheet are numbered #1, #2 ... from top to bottom, then left to right.)
*#13  RevCode: v0.2  Page Number: 13  Page Count: 22  Drawing: qxn  (hidden comment: Seeed Title)  (graphical)
R134  value 10K  Rating: 1%  [R0402]  (hidden comment: R)
R140  value 10K  Rating: 1%  [R0402]  (hidden comment: R)
R142  value 10K  Rating: 1%  [R0402]  (hidden comment: R)
R143  value 10K  Rating: 1%  [R0402]  (hidden comment: R)
R144  value 10K  Rating: 1%  [R0402]  (hidden comment: R)
R148  value 10K  Rating: 1%  [R0402]  (hidden comment: R)
R244  value 33R  Rating: 5%  [R0201]  (hidden comment: R)
R273  value 33R  Rating: 5%  [R0201]  (hidden comment: R)
U1  value AM62x  Package Size: BGA425  [bga425_0d5_13x13mm]  (hidden comment: AM62x_BGA425)  (parts A,E,J of 19)

### Nets
VDD_3V3: R134.1 R140.1 R142.1 R143.1 R144.1 R148.1
BL_EN_3V3: U1.H24(OSPI0_CLK) ; off-sheet BL_EN_3V3
BL_PWM_3V3: R244.1 ; off-sheet BL_PWM_3V3
CC1352_BOOT: U1.H21(OSPI0_CSN2) ; off-sheet CC1352_BOOT
CC1352_RSTn: U1.E24(OSPI0_CSN3) ; off-sheet CC1352_RSTn
CLKOUT0: R273.2 ; off-sheet CLKOUT0
CSI0_GPIO1: U1.F23(OSPI0_CSN0) ; off-sheet CSI0_GPIO1
CSI0_GPIO2: U1.G21(OSPI0_CSN1) ; off-sheet CSI0_GPIO2
EEP_WP: U1.J22(OSPI0_D7) ; off-sheet EEP_WP
GPIO1_9: U1.B18(MCASP0_AXR1) ; off-sheet GPIO1_9
GPIO1_10: U1.E18(MCASP0_AXR0) ; off-sheet GPIO1_10  [project net AIN1]
GPIO1_11: U1.B20(MCASP0_ACLKX) ; off-sheet GPIO1_11
GPIO1_12: U1.D20(MCASP0_AFSX) ; off-sheet GPIO1_12
I2C0_SCL: R144.2 U1.B16(I2C0_SCL) ; off-sheet I2C0_SCL
I2C0_SDA: R143.2 U1.A16(I2C0_SDA) ; off-sheet I2C0_SDA
I2C1_SCL: R142.2 U1.B17(I2C1_SCL) ; off-sheet I2C1_SCL  [project net AIN2]
I2C1_SDA: R140.2 U1.A17(I2C1_SDA) ; off-sheet I2C1_SDA
I2C3_SCL: R134.2 U1.A15(UART0_CTSN) ; off-sheet I2C3_SCL
I2C3_SDA: R148.2 U1.B15(UART0_RTSN) ; off-sheet I2C3_SDA
LED_USR0: U1.E25(OSPI0_D0) ; off-sheet LED_USR0
LED_USR1: U1.G24(OSPI0_D1) ; off-sheet LED_USR1
LED_USR2: U1.F25(OSPI0_D2) ; off-sheet LED_USR2
LED_USR3: U1.F24(OSPI0_D3) ; off-sheet LED_USR3
LED_USR4: U1.H25(OSPI0_D6) ; off-sheet LED_USR4
MST_RST_3V3: U1.A13(SPI0_CS0) ; off-sheet MST_RST_3V3
PO_EN: U1.G25(OSPI0_LBCLKO) ; off-sheet PO_EN
RTC_INT: U1.J24(OSPI0_DQS) ; off-sheet RTC_INT
SD_PWR_EN: U1.B14(SPI0_D1) ; off-sheet SD_PWR_EN
SPI2_CLK: U1.A20(MCASP0_ACLKR) ; off-sheet SPI2_CLK
SPI2_CS0: U1.E19(MCASP0_AFSR) ; off-sheet SPI2_CS0
SPI2_D0: U1.B19(MCASP0_AXR3) ; off-sheet SPI2_D0
SPI2_D1: U1.A19(MCASP0_AXR2) ; off-sheet SPI2_D1
UART0_RXD: U1.D14(UART0_RXD) ; off-sheet UART0_RXD
UART0_TXD: U1.E14(UART0_TXD) ; off-sheet UART0_TXD
UART5_RXD: U1.C15(MCAN0_TX) ; off-sheet UART5_RXD
UART5_TXD: U1.E15(MCAN0_RX) ; off-sheet UART5_TXD
UART6_RXD: U1.J23(OSPI0_D4) ; off-sheet UART6_RXD
UART6_TXD: U1.J25(OSPI0_D5) ; off-sheet UART6_TXD
NetR244_2: R244.2 U1.C13(SPI0_CS1)
NetR273_1: R273.1 U1.A18(EXT_REFCLK1)

Not connected (* = marked no-connect by the designer): U1 A2(VSENSE)* A14(SPI0_CLK)* AE2(ATEST1)* B1(IFORCE)* B13(SPI0_D0)* F6(ATEST0)*

### Notes on the sheet
- SoC GPIO 3.3V
- MCAN0_RX, UART5_TXD, TIMER_IO3, EQEP2_S, PR0_UART0_TXD, GPIO1_25, MCASP2_AXR1
- MCAN0_TX, UART5_RXD, TIMER_IO2, EQEP2_I, PR0_UART0_RXD, GPIO1_24, MCASP2_AXR0
- SPI0_CS2, I2C3_SCL, UART2_RXD, TIMER_IO6, AUDIO_EXT_REFCLK0, GPIO1_22, MCASP2_AFSX
- (near U1) 3.3V
- SPI0_CS3, I2C3_SDA, UART2_TXD, TIMER_IO7, AUDIO_EXT_REFCLK1, GPIO1_23, MCASP2_ACLKX
- GPIO0_0
- GPIO0_5
- GPIO0_3
- GPIO0_4
- GPIO0_6
- 3.3V
- GPIO0_9
- GPIO0_7
- GPIO0_8
- GPIO0_10
- GPIO0_11
- GPIO0_12
- GPIO0_13
- GPIO0_14
- GPIO0_1
- GPIO0_2
- MCASP0_AXR0, PR0_ECAP0_IN_APWM_OUT, AUDIO_EXT_REFCLK0, PR0_UART0_TXD, EHRPWM1_B, GPIO1_10, EQEP1_I
- MCASP0_AXR1, SPI2_CS2, ECAP1_IN_AWPM_OUT, PR0_UART0_RXD, EHRPWM1_A, GPIO1_9, EQEP0_S
- MCASP0_ACLKR, SPI2_CLK, UART1_TXD, EHRPWM0_B, GPIO1_14, EQEP1_I
- MCASP0_AXR3, SPI2_D0, UART6_RXD, ECAP1_IN_APWM_OUT, PR0_UART0_RXD, GPIO1_7, EQEP0_A
- MCASP0_AXR2, SPI2_D1, UART6_TXD, ECAP2_IN_APWM_OUT, PR0_UART0_TXD, GPIO1_8, EQEP0_B
- MCASP0_ACLKX, SPI2_CS1, ECAP2_IN_APWM_OUT, GPIO1_11, EQEP1_A
- MCASP0_AFSR, SPI2_CS0, UART1_RXD, EHRWPM0_A, GPIO1_13, EQEP1_S
- MCASP0_AFSX, SPI2_CS3, AUDIO_EXT_REFCLK1, GPIO1_12, EQEP1_B
- (in symbol AM62x_BGA425, part A) GENERAL; PwrGrp:VDDSHV0; OSC0; PwrGrp:VDDS_OSC
- (in symbol AM62x_BGA425, part E) MCASP0; PwrGrp:VDDSHV0
- (in symbol AM62x_BGA425, part J) OSPI; PwrGrp:VDDSHV1
- (in symbol Seeed Title) https://www.seeedstudio.com; Title:; Size:; Document Number:; Rev:; Draw By:; Date:; Sheet:; of

### Library data of the parts
*#13 = Seeed Title: Company: Seeed Studio; WebSite: https://www.seeedstudio.com; Schematic Name: =SchematicName; Page Size: =PageSize; Page Name: =PageName; Page Create Date: May 29, 2006; Page Modify Date: =ModifiedDate
R134 = R: RES, Thick Film, 10K, 1%, 1/16W, SMD, 0402; Part Reference: R134; Manufacturer PN: RC0402FR-0710KL; Manufacturer: YAGEO; Company Part Status: BeagleBone Carrier Board; CLASS: DISCRETE; PN: 301010047; PCB Footprint: R0402; Package Size: 0402; Rated Power: 1/16W
R140 = R: RES, Thick Film, 10K, 1%, 1/16W, SMD, 0402; Part Reference: R140; Company Part Status: BeagleBone Carrier Board; Manufacturer: YAGEO; Manufacturer PN: RC0402FR-0710KL; PN: 301010047; CLASS: DISCRETE; PCB Footprint: R0402; Package Size: 0402; Rated Power: 1/16W
R142 = R: RES, Thick Film, 10K, 1%, 1/16W, SMD, 0402; Part Reference: R142; Company Part Status: BeagleBone Carrier Board; Manufacturer: YAGEO; Manufacturer PN: RC0402FR-0710KL; PN: 301010047; CLASS: DISCRETE; PCB Footprint: R0402; Package Size: 0402; Rated Power: 1/16W
R143 = R: RES, Thick Film, 10K, 1%, 1/16W, SMD, 0402; Part Reference: R143; Company Part Status: BeagleBone Carrier Board; Manufacturer: YAGEO; Manufacturer PN: RC0402FR-0710KL; PN: 301010047; CLASS: DISCRETE; PCB Footprint: R0402; Package Size: 0402; Rated Power: 1/16W
R144 = R: RES, Thick Film, 10K, 1%, 1/16W, SMD, 0402; Part Reference: R144; Company Part Status: BeagleBone Carrier Board; Manufacturer: YAGEO; Manufacturer PN: RC0402FR-0710KL; PN: 301010047; CLASS: DISCRETE; PCB Footprint: R0402; Package Size: 0402; Rated Power: 1/16W
R148 = R: RES, Thick Film, 10K, 1%, 1/16W, SMD, 0402; Part Reference: R148; Manufacturer PN: RC0402FR-0710KL; Manufacturer: YAGEO; Company Part Status: BeagleBone Carrier Board; CLASS: DISCRETE; PN: 301010047; PCB Footprint: R0402; Package Size: 0402; Rated Power: 1/16W
R244 = R: RES, Thick Film, 33R, 5%, 1/20W, SMD, 0201; Part Reference: R244; Company Part Status: BeagleBone Carrier Board; Manufacturer: YAGEO; Manufacturer PN: RC0201JR-0733RL; PN: 301010675; CLASS: DISCRETE; PCB Footprint: R0201; Package Size: 0201; Rated Power: 1/20W
R273 = R: RES, Thick Film, 33R, 5%, 1/20W, SMD, 0201; Part Reference: R273; Manufacturer PN: RC0201JR-0733RL; Manufacturer: YAGEO; Company Part Status: BeagleBone Carrier Board; CLASS: DISCRETE; PN: 301010675; PCB Footprint: R0201; Rated Power: 1/20W; Package Size: 0201
U1 = AM62x_BGA425: IC, Controller, MPU, AM62x, BGA425; Part Reference: U1; Manufacturer PN: AM6254ATCGGHALWR; Manufacturer: TI; Company Part Status: BeaglePlay; PN: 310011537; PCB Footprint: bga425_0d5_13x13mm; CLASS: IC